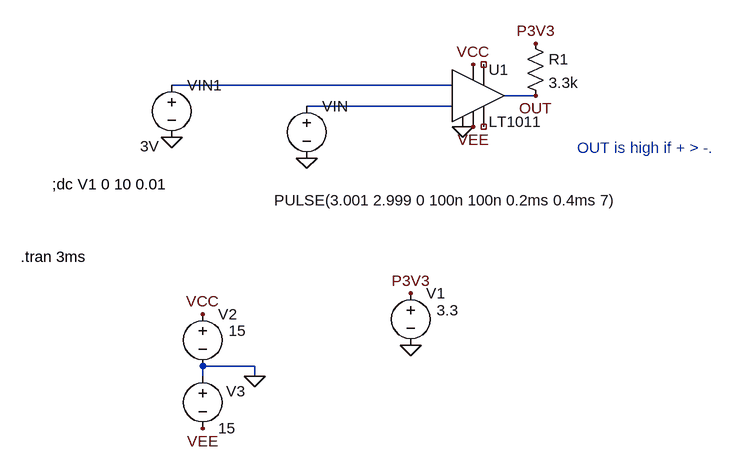
[diagram p0: schematic Draft44.asc]
Draft44.asc, the LTspice schematic file:
Version 4
SHEET 1 1440 868
WIRE 64 192 -368 192
WIRE 192 208 144 208
WIRE 64 224 -160 224
WIRE -240 624 -320 624
WIRE -320 640 -320 624
WIRE -240 640 -240 624
FLAG -368 272 0
FLAG -240 640 0
FLAG -320 544 VCC
FLAG -320 720 VEE
FLAG -160 304 0
FLAG 96 160 VCC
FLAG 96 256 VEE
FLAG 80 256 0
FLAG 0 512 P3V3
FLAG 0 592 0
FLAG 192 128 P3V3
FLAG 192 208 OUT
SYMBOL voltage -160 208 R0
WINDOW 123 0 0 Left 0
WINDOW 39 0 0 Left 0
WINDOW 3 -50 161 Left 2
SYMATTR Value PULSE(3.001 2.999 0 100n 100n 0.2ms 0.4ms 7)
SYMATTR InstName VIN
SYMBOL voltage -320 528 R0
WINDOW 123 0 0 Left 0
WINDOW 39 0 0 Left 0
WINDOW 3 40 42 Left 2
SYMATTR Value 15
SYMATTR InstName V2
SYMBOL voltage -320 624 R0
WINDOW 123 0 0 Left 0
WINDOW 39 0 0 Left 0
WINDOW 0 36 39 Left 2
SYMATTR InstName V3
SYMATTR Value 15
SYMBOL voltage -368 176 R0
WINDOW 123 0 0 Left 0
WINDOW 39 0 0 Left 0
WINDOW 3 -48 110 Left 2
SYMATTR Value 3V
SYMATTR InstName VIN1
SYMBOL res 176 112 R0
SYMATTR InstName R1
SYMATTR Value 3.3k
SYMBOL voltage 0 496 R0
WINDOW 123 0 0 Left 0
WINDOW 39 0 0 Left 0
WINDOW 3 40 42 Left 2
SYMATTR Value 3.3
SYMATTR InstName V1
SYMBOL Comparators\\LT1011 96 208 R0
SYMATTR InstName U1
TEXT -552 344 Left 2 !;dc V1 0 10 0.01
TEXT -600 456 Left 2 !.tran 3ms
TEXT 256 288 Left 2 ;OUT is high if + > -.

The netlist it stands for:
* Draft44.asc
VIN N002 0 PULSE(3.001 2.999 0 100n 100n 0.2ms 0.4ms 7)
V2 VCC 0 15
V3 0 VEE 15
VIN1 N001 0 3V
R1 P3V3 OUT 3.3k
V1 P3V3 0 3.3
XU1 0 N002 N001 VEE NC_01 NC_02 OUT VCC LT1011
;dc V1 0 10 0.01
.tran 3ms
* OUT is high if + > -.
.lib LTC1.lib
.backanno
.end